# Altium schematic sheet nfc-epd-top.schdoc
size Letter
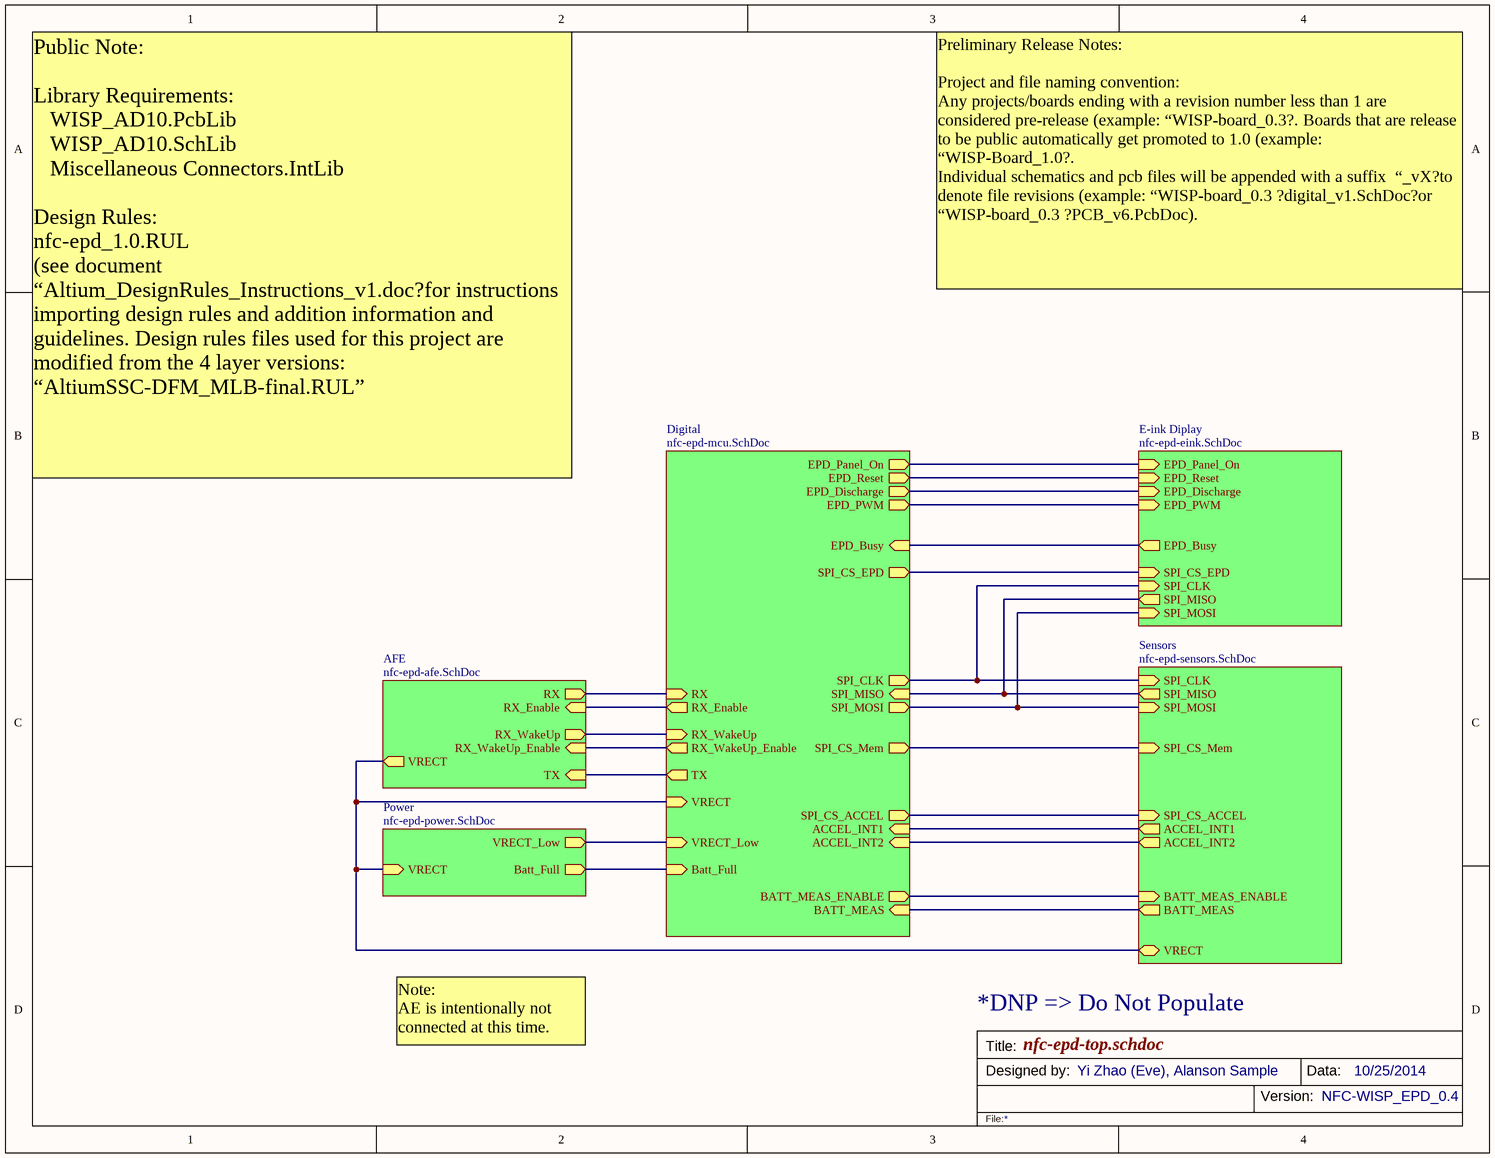
[diagram p0: nfc-epd-top.schdoc]

## Sub-sheets
AFE = nfc-epd-afe.SchDoc: RX (out), TX (in), RX_Enable (in), RX_WakeUp (out), RX_WakeUp_Enable (in), VRECT (out)
Digital = nfc-epd-mcu.SchDoc: RX (in), TX (out), RX_Enable (out), SPI_MOSI (out), SPI_MISO (in), SPI_CLK (out), RX_WakeUp (in), RX_WakeUp_Enable (out), VRECT_Low (in), BATT_MEAS_ENABLE (out), BATT_MEAS (in), SPI_CS_EPD (out), EPD_Busy (in), EPD_Reset (out), EPD_Panel_On (out), EPD_Discharge (out), EPD_PWM (out), SPI_CS_Mem (out), Batt_Full (in), VRECT (in), ACCEL_INT1 (in), ACCEL_INT2 (in), SPI_CS_ACCEL (out)
E-ink Diplay = nfc-epd-eink.SchDoc: SPI_CS_EPD (in), EPD_Busy (out), SPI_CLK (in), SPI_MOSI (in), SPI_MISO (out), EPD_Reset (in), EPD_Panel_On (in), EPD_Discharge (in), EPD_PWM (in)
Power = nfc-epd-power.SchDoc: VRECT_Low (out), VRECT (in), Batt_Full (out)
Sensors = nfc-epd-sensors.SchDoc: VRECT, BATT_MEAS_ENABLE (in), BATT_MEAS (out), SPI_MOSI (in), SPI_MISO (out), SPI_CS_Mem (in), SPI_CLK (in), SPI_CS_ACCEL (in), ACCEL_INT1 (out), ACCEL_INT2 (out)

## Nets
(unnamed): sheet Digital/RX, sheet AFE/RX
(unnamed): sheet Digital/TX, sheet AFE/TX
(unnamed): sheet Digital/RX_Enable, sheet AFE/RX_Enable
(unnamed): sheet Digital/SPI_MOSI, sheet Sensors/SPI_MOSI, sheet E-ink Diplay/SPI_MOSI
(unnamed): sheet Digital/SPI_MISO, sheet Sensors/SPI_MISO, sheet E-ink Diplay/SPI_MISO
(unnamed): sheet Digital/SPI_CLK, sheet Sensors/SPI_CLK, sheet E-ink Diplay/SPI_CLK
(unnamed): sheet Digital/RX_WakeUp, sheet AFE/RX_WakeUp
(unnamed): sheet Digital/RX_WakeUp_Enable, sheet AFE/RX_WakeUp_Enable
(unnamed): sheet Digital/VRECT_Low, sheet Power/VRECT_Low
(unnamed): sheet Digital/BATT_MEAS_ENABLE, sheet Sensors/BATT_MEAS_ENABLE
(unnamed): sheet Digital/BATT_MEAS, sheet Sensors/BATT_MEAS
(unnamed): sheet Digital/SPI_CS_EPD, sheet E-ink Diplay/SPI_CS_EPD
(unnamed): sheet Digital/EPD_Busy, sheet E-ink Diplay/EPD_Busy
(unnamed): sheet Digital/EPD_Reset, sheet E-ink Diplay/EPD_Reset
(unnamed): sheet Digital/EPD_Panel_On, sheet E-ink Diplay/EPD_Panel_On
(unnamed): sheet Digital/EPD_Discharge, sheet E-ink Diplay/EPD_Discharge
(unnamed): sheet Digital/EPD_PWM, sheet E-ink Diplay/EPD_PWM
(unnamed): sheet Digital/SPI_CS_Mem, sheet Sensors/SPI_CS_Mem
(unnamed): sheet Digital/Batt_Full, sheet Power/Batt_Full
(unnamed): sheet Digital/VRECT, sheet Sensors/VRECT, sheet Power/VRECT, sheet AFE/VRECT
(unnamed): sheet Digital/ACCEL_INT1, sheet Sensors/ACCEL_INT1
(unnamed): sheet Digital/ACCEL_INT2, sheet Sensors/ACCEL_INT2
(unnamed): sheet Digital/SPI_CS_ACCEL, sheet Sensors/SPI_CS_ACCEL

## Notes on the sheet
- Preliminary Release Notes:
  Project and file naming convention:
  Any projects/boards ending with a revision number less than 1 are considered pre-release (example: “WISP-board_0.3?. Boards that are release to be public automatically get promoted to 1.0 (example: “WISP-Board_1.0?.
  Individual schematics and pcb files will be appended with a suffix  “_vX?to denote file revisions (example: “WISP-board_0.3 ?digital_v1.SchDoc?or “WISP-board_0.3 ?PCB_v6.PcbDoc).
- Public Note:
  Library Requirements:
  WISP_AD10.PcbLib
  WISP_AD10.SchLib
  Miscellaneous Connectors.IntLib
  Design Rules:
  nfc-epd_1.0.RUL
  (see document “Altium_DesignRules_Instructions_v1.doc?for instructions importing design rules and addition information and guidelines. Design rules files used for this project are modified from the 4 layer versions:  “AltiumSSC-DFM_MLB-final.RUL”
- Note:
  AE is intentionally not connected at this time.
- *DNP => Do Not Populate
- Title:
- Designed by:
- Yi Zhao (Eve), Alanson Sample
- Version:
- Data:
- NFC-WISP_EPD_0.4
- 10/25/2014
- File: